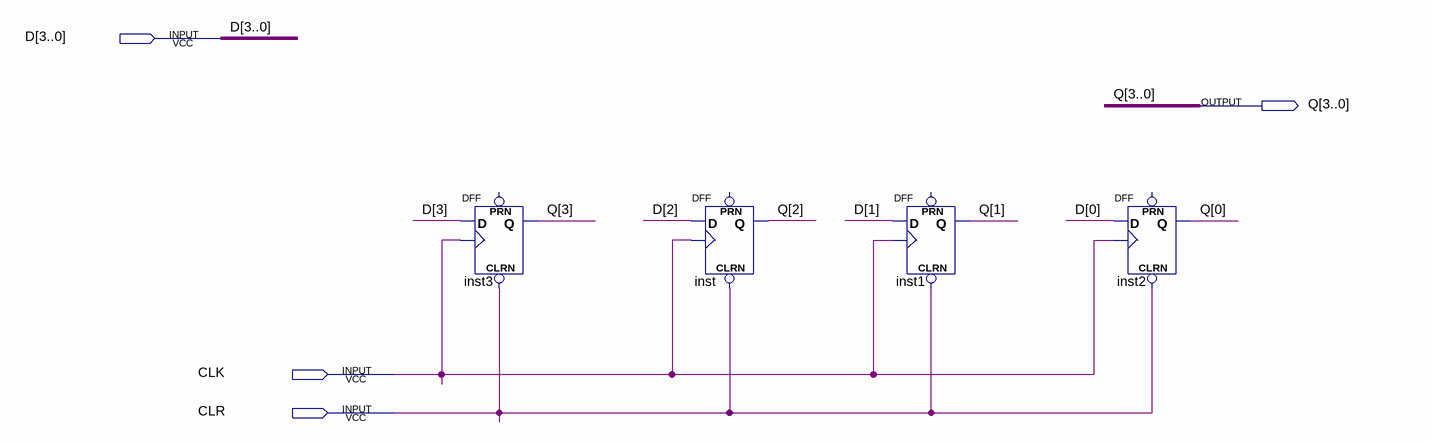
[diagram p0: schematic sheet]
// Quartus schematic CurrentState.bdf as structural Verilog: 4 symbols, 4 pins
module CurrentState (
  input  [3:0] D,
  input  CLK,
  input  CLR,
  output [3:0] Q
);

  DFF inst3 (.CLRN(CLR), .CLK(CLK), .D(D[3]), .Q(Q[3]));  // open: PRN
  DFF inst (.CLRN(CLR), .CLK(CLK), .D(D[2]), .Q(Q[2]));  // open: PRN
  DFF inst1 (.CLRN(CLR), .CLK(CLK), .D(D[1]), .Q(Q[1]));  // open: PRN
  DFF inst2 (.CLRN(CLR), .CLK(CLK), .D(D[0]), .Q(Q[0]));  // open: PRN
endmodule
